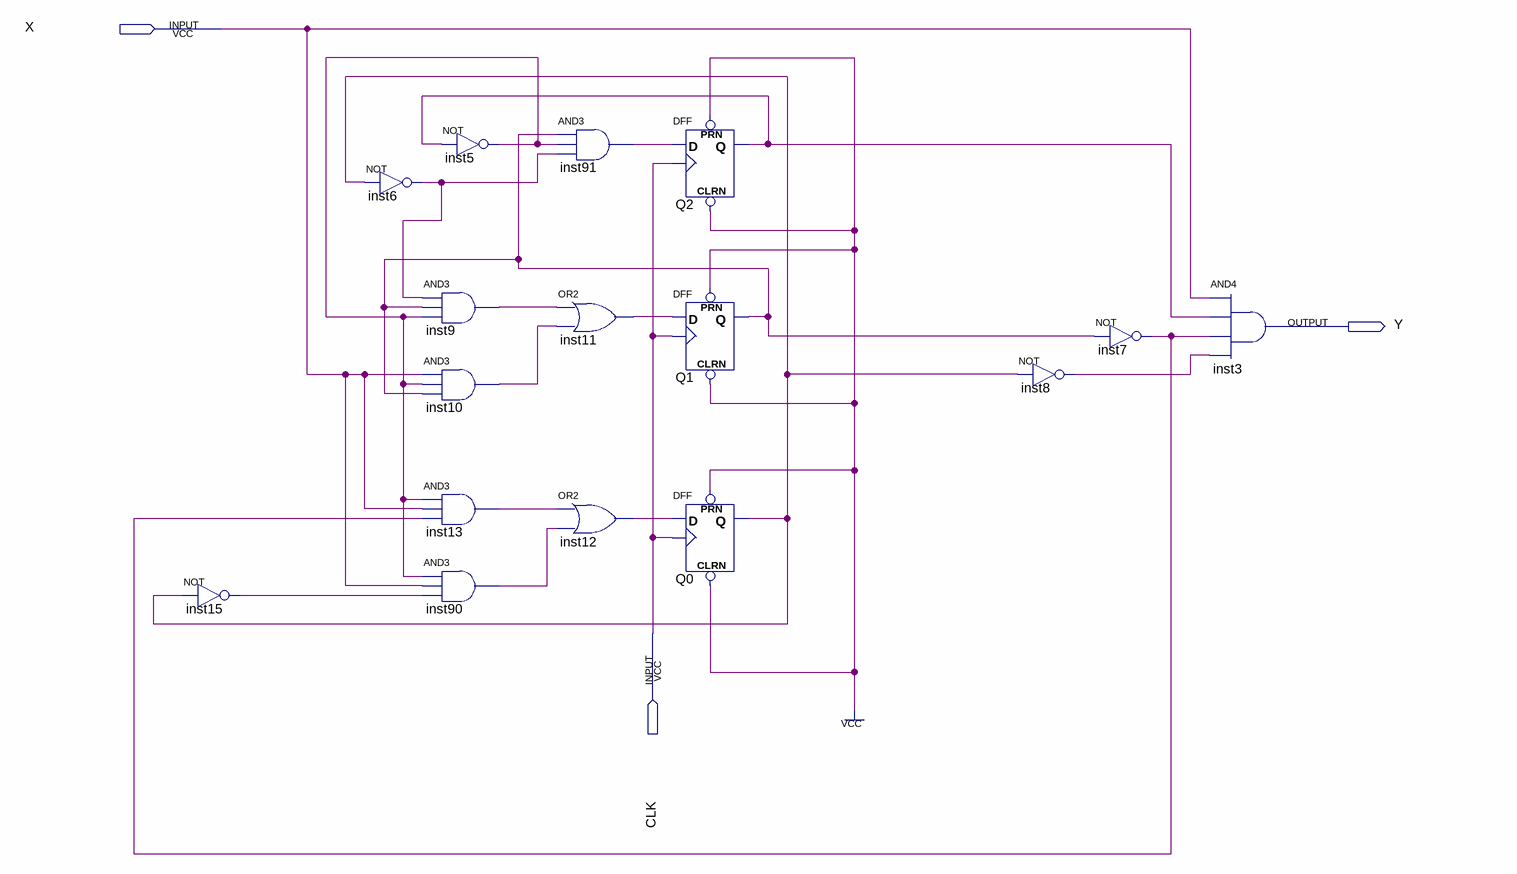
[diagram p0: schematic sheet]
// Quartus schematic SeqDet3in5.bdf as structural Verilog: 16 symbols, 3 pins
module SeqDet3in5 (
  input  X,
  input  CLK,
  output Y
);

  wire inst5_out, inst6_out, inst7_out, inst8_out, inst9_out, inst10_out, inst11_out, inst12_out, inst13_out,
       inst15_out, inst90_out, inst91_out, Q0_q, Q1_q, Q2_q;

  not inst15 (inst15_out, Q0_q);
  not inst6 (inst6_out, Q0_q);
  not inst5 (inst5_out, Q2_q);
  and inst9 (inst9_out, inst6_out, Q1_q, inst5_out);
  and inst10 (inst10_out, X, inst5_out, Q1_q);
  and inst13 (inst13_out, inst5_out, X, inst7_out);
  and inst90 (inst90_out, inst5_out, X, inst15_out);
  and inst91 (inst91_out, Q1_q, inst5_out, inst6_out);
  or inst11 (inst11_out, inst9_out, inst10_out);
  or inst12 (inst12_out, inst13_out, inst90_out);
  DFF Q2 (.CLRN(1'b1), .CLK(CLK), .D(inst91_out), .PRN(1'b1), .Q(Q2_q));
  DFF Q1 (.CLRN(1'b1), .CLK(CLK), .D(inst11_out), .PRN(1'b1), .Q(Q1_q));
  DFF Q0 (.CLRN(1'b1), .CLK(CLK), .D(inst12_out), .PRN(1'b1), .Q(Q0_q));
  not inst8 (inst8_out, Q0_q);
  not inst7 (inst7_out, Q1_q);
  and inst3 (Y, X, Q2_q, inst7_out, inst8_out);
endmodule
